# Altium schematic sheet Ultra-Mega-PS-Block-V1.00.SchDoc: Ultra-Mega-PowerSupply
size A4; Author: Felipe Navarro; SheetNumber: 1; SheetTotal: 5
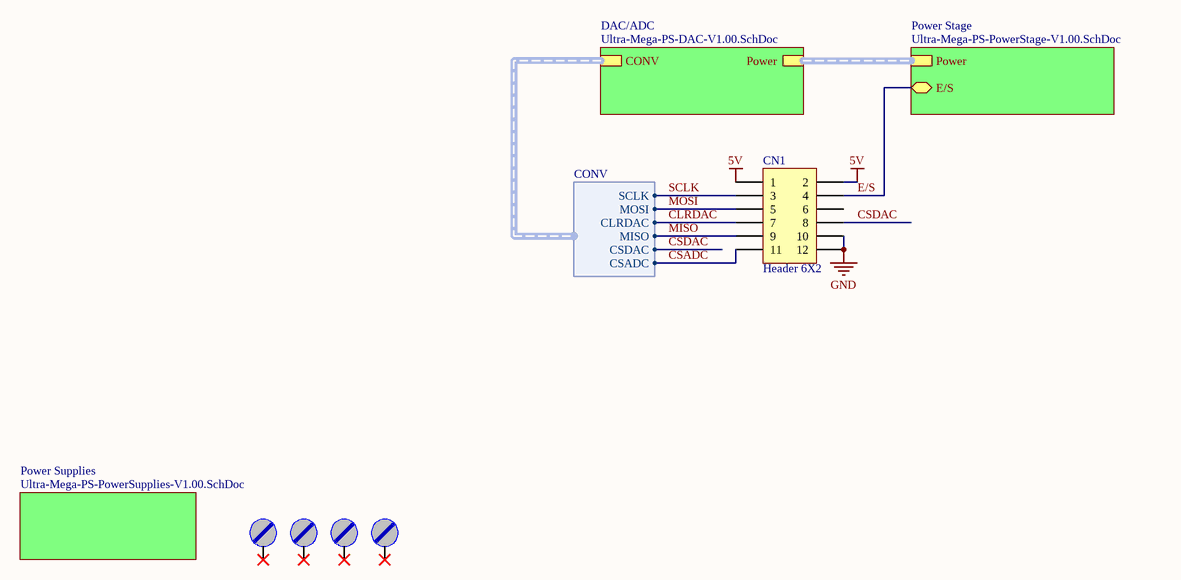
[diagram p0: Ultra-Mega-PS-Block-V1.00.SchDoc]

## Parts
CN1  Header 6X2  [CONN HDR2X6]
HOLE1  Furo de Fixação  [Furo_M3]  (value not drawn)  (no BOM)
HOLE2  Furo de Fixação  [Furo_M3]  (value not drawn)  (no BOM)
HOLE3  Furo de Fixação  [Furo_M3]  (value not drawn)  (no BOM)
HOLE4  Furo de Fixação  [Furo_M3]  (value not drawn)  (no BOM)

## Sub-sheets
DAC/ADC = Ultra-Mega-PS-DAC-V1.00.SchDoc: Power (harness Power), CONV (harness CONV)
Power Stage = Ultra-Mega-PS-PowerStage-V1.00.SchDoc: Power (harness Power), E/S
Power Supplies = Ultra-Mega-PS-PowerSupplies-V1.00.SchDoc: no entries

## Harnesses
CONV: SCLK, MOSI, CLRDAC, MISO, CSDAC, CSADC

## Nets
5V: CN1.1 CN1.2
GND: CN1.10 CN1.12
CLRDAC: CN1.7 ; sheet DAC/ADC/CONV.CLRDAC
CSADC: CN1.11 ; sheet DAC/ADC/CONV.CSADC
CSDAC: CN1.8 ; sheet DAC/ADC/CONV.CSDAC
E/S: CN1.4 ; sheet Power Stage/E/S
MISO: CN1.9 ; sheet DAC/ADC/CONV.MISO
MOSI: CN1.5 ; sheet DAC/ADC/CONV.MOSI
SCLK: CN1.3 ; sheet DAC/ADC/CONV.SCLK

Not connected (* = marked no-connect by the designer): CN1 6; HOLE1 X*; HOLE2 X*; HOLE3 X*; HOLE4 X*

## Buses and harness runs
harness sheet DAC/ADC/Power = sheet Power Stage/Power

## Notes on the sheet
- Projeto:
- Tamanho:
- Data:
- A4
- Eng. Felipe Navarro
- Hora:
- Revisão:
- Folha
- de
- Arquivo:

## Library data of the parts
CN1 = Header 6X2: Header, 6-Pin, Dual row; ChinesePrice: 0,00000; Chinês: ----; Corrente: *; Potência: *; Supplier 1: Digi-Key; Supplier Part Number 1: --Del; Tensão: *; Value: *; Obs:: *; Tolerância: *; ComponentLink1Description: Datasheet; ComponentLink1URL: D:\Tecnoclade\Datasheet\!DataMissing.pdf
HOLE1-HOLE4 = Parafuso: Furo para parafuso; Value: M3; ChinesePrice: 0,00000; Chinês: ----; Corrente: *; Potência: *; Supplier 1: Digi-Key; Supplier Part Number 1: --Del; Tensão: *; Obs:: *; Tolerância: *; ComponentLink1Description: Datasheet; ComponentLink1URL: D:\Tecnoclade\Datasheet\!DataMissing.pdf